# EAGLE design RFM69HCW_Breakout (EAGLE 7.7.0)
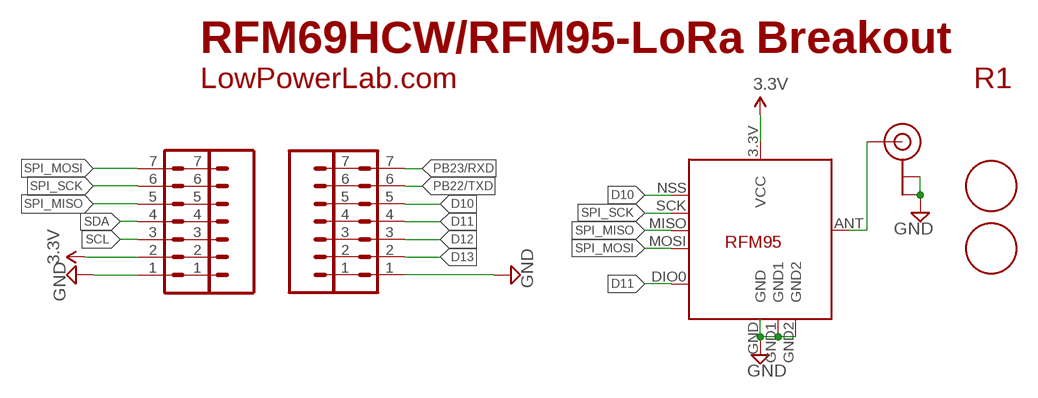
[diagram p0: schematic, sheet 1]

## Parts
FIDUCIAL_UPPERLEFT  FIDUCIAL1.5MM  [FIDUCIAL_1.5MM]
U$4  HDR_7PINNS_THINRINGS  [1X07_NS_THINRINGS]
U$9  FIDUCIAL1.5MM  [FIDUCIAL_1.5MM]
U$10  HDR_7PINNS_THINRINGS  [1X07_NS_THINRINGS]
U$16  RFM95COMPACT  [RFM95]
U$17  HDR_7PINHH  [1X07_NS_THINRINGS_HH]
U$18  HDR_7PINHH  [1X07_NS_THINRINGS_HH]
X2  U.FLW  [U.FL_WIDER]

## Nets
3.3V: U$16.3.3V(VCC) U$18.2
ANT: U$16.ANT X2.SIGNAL
D10: U$16.NSS(SEL) U$17.5
D11: U$16.DIO0 U$17.4
D12: U$17.3
D13: U$17.2
GND: U$16.GND U$16.GND1 U$16.GND2 U$17.1 U$18.1 X2.GND1(GND) X2.GND2(GND)
PB22/TXD: U$17.6
PB23/RXD: U$17.7
SCL: U$18.3
SDA: U$18.4
SPI_MISO: U$16.MISO U$18.5
SPI_MOSI: U$16.MOSI U$18.7
SPI_SCK: U$16.SCK U$18.6
Unconnected: FIDUCIAL_UPPERLEFT.P$1(FIDUCIAL) U$4.1 U$4.2 U$4.3 U$4.4 U$4.5 U$4.6 U$4.7 U$9.P$1(FIDUCIAL) U$10.1 U$10.2 U$10.3 U$10.4 U$10.5 U$10.6 U$10.7

## Notes on the sheet
- RFM69HCW/RFM95-LoRa Breakout
- LowPowerLab.com | R1

## Library data of the parts
FIDUCIAL_UPPERLEFT U$9 = LowPowerLab:FIDUCIAL
U$4 U$10 U$17 U$18 = LowPowerLab:HDR_7PIN
U$16 = LowPowerLab:RFM95
X2 = LowPowerLab:U.FL: SMD antenna connector- WRL-09144

## Net classes
1 power: width 0.381 mm, clearance 0.254 mm

## Board
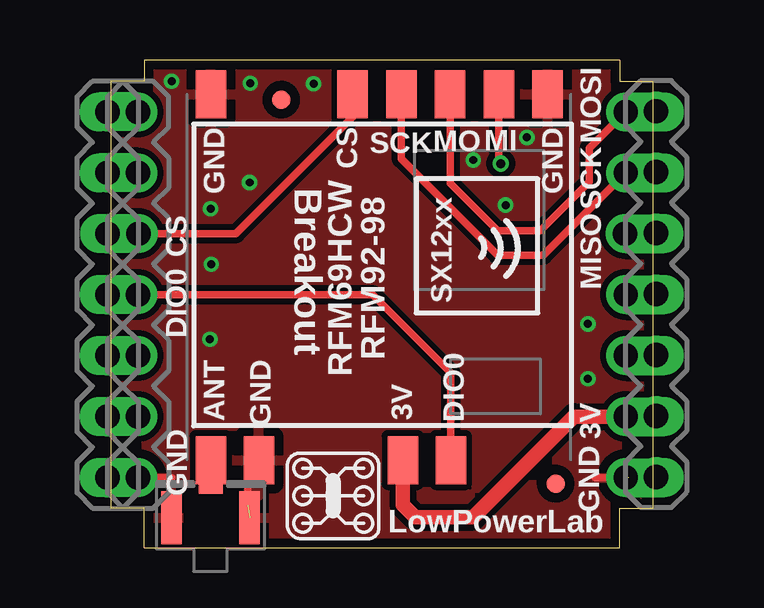
[diagram p1: board, top side]
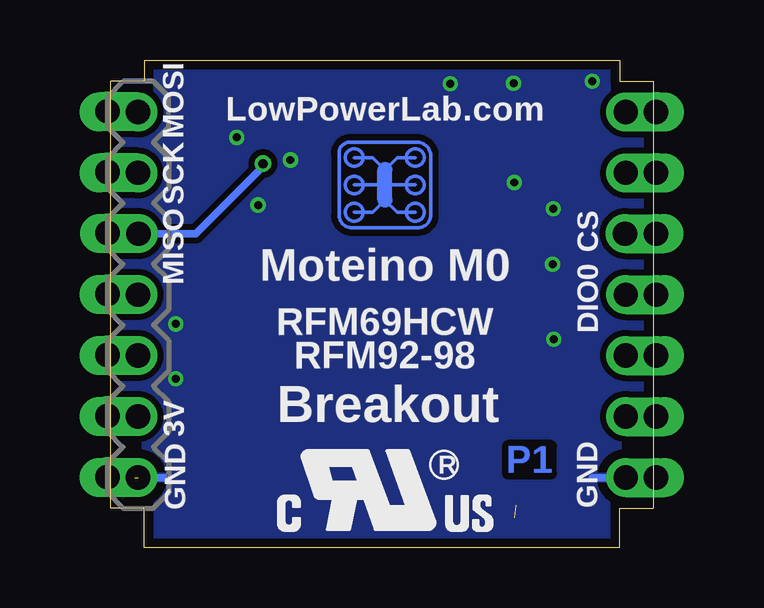
[diagram p2: board, bottom side, seen from below]

Size 22.61 x 20.32 mm. Coordinates in mm from the lower left corner, seen from the top.
Outline: 0,19.43 0,1.65 1.4,1.65 1.4,0 21.21,0 21.21,1.65 22.61,1.65 22.61,19.43 21.21,19.43 21.21,20.32 1.4,20.32 1.4,19.43 0,19.43
Copper layers (1*16): Top 0.0356mm / dielectric 1.5011mm / Bottom 0.0356mm
Design rules "LaenPCBOrder *": minimum track width 6mil, minimum drill 12mil, track to track 10mil, track to pad 10mil, pad to pad 6mil, via to via 6mil, smd to smd 6mil, copper to edge 15mil, drill to drill 10mil, minimum pad ring 10mil, minimum via ring 6mil, stop-mask expansion 2mil, vias tented up to drill 25mil, thermal gap 15mil
tRestrict: area 3,0.4 to 5.3,2.3; area 3.7,17.7 to 4.6,17.9

### Footprints (pad centres in the part's own frame; a part is rotated, then mirrored left to right if it is on the bottom)
FIDUCIAL_1.5MM = smd 0.762 x 0.762: P$1 0,0
1X07_NS_THINRINGS = drill 1.016 pad 1.626: 1 0,0; 2 2.54,0; 3 5.08,0; 4 7.62,0; 5 10.16,0; 6 12.7,0; 7 15.24,0
RFM95 = smd 2 x 1.27: 3.3V 7.651,1; ANT 7.651,-7; DIO0 7.651,3; GND 7.651,-5; GND1 -7.599,-7; GND2 -7.599,7.032; MISO -7.599,5; MOSI -7.599,2.968; NSS -7.599,-1.096; SCK -7.599,0.936
1X07_NS_THINRINGS_HH = drill 1.016 pad 1.626 offset: 1 0,0; 2 2.54,0; 3 5.08,0; 4 7.62,0; 5 10.16,-0.025; 6 12.7,0; 7 15.24,0
U.FL_WIDER = smd 2.2 x 0.85: GND1 0,1.629; GND2 0,-1.629 | smd 1.05 x 1: SIGNAL 1.525,0

### Placement (x,y rotation side)
FIDUCIAL_UPPERLEFT  18.54,2.67 270 top
U$1  [LOGO_LOWPOWERLAB]  9.27,2.16 0 top
U$2  [LOGO_UL]  15.62,0.64 0 bottom
U$3  [LOGO_LOWPOWERLAB_COPPER]  11.18,15.11 180 bottom
U$4  22.73,2.95 90 top
U$7  [LOGO_LOWPOWERLAB_STOP]  11.18,15.11 180 bottom
U$9  7.11,18.67 270 top
U$10  -0.13,2.92 90 top
U$16  11.18,11.3 270 top
U$17  1.14,2.92 90 top
U$18  21.46,2.92 90 bottom
X2  4.17,1.24 90 top

### Tracks (layer width: path | path; a pad name or v marks a point on that pad's centre or on a via)
3.3V
  Top 0.61: U$16.3.3V 12.18,1.79 12.7,1.27 15.11,1.27 19.3,5.46 U$18.2
ANT
  Top 0.305: X2.SIGNAL U$16.ANT
D10
  Top 0.305: U$16.NSS 10.08,17.95 5.21,13.08 U$17.5
D11
  Top 0.305: U$16.DIO0 14.18,7.29 10.92,10.54 U$17.4
GND  (via drill 0.33)  (3 unrouted)
  Top 0.305: U$17.1 2.54,2.92 | 20.19,2.92 21.59,2.92 | 5.71,1.78 5.71,3.17
  Bottom 0.305: U$17.1 2.54,2.92 | 20.19,2.92 21.59,2.92
  other vias: 4.19,11.81 5.82,19.35 8.46,19.33 4.17,14.12 5.79,15.21 17.35,17.09 16.46,14.27 15.11,16.15 19.89,7.04 19.89,9.32 4.14,8.69 2.54,19.43
  pour Top: 22.73,20.32 -0.13,20.32 -0.43,-0.2 22.68,-0.2
  pour Bottom: 22.73,20.32 22.68,-0.25 -0.43,-0.25 -0.13,20.32
SPI_MISO  (via drill 0.38)
  Top 0.305: U$16.MISO 16.18,16.08 v16.26,16
  Bottom 0.305: v16.26,16 16.26,15.88 19.05,13.08 U$18.5
SPI_MOSI
  Top 0.305: U$16.MOSI 14.14,15.19 16.13,13.21 17.91,13.21 19.94,15.24 19.94,16.64 U$18.7
SPI_SCK
  Top 0.305: U$16.SCK 12.11,16.21 16.13,12.19 18.03,12.19 U$18.6

### Text on the board
Bottom: P1
tPlace: MOSI | CS | SCK | MO | MI | GND | GND | Breakout | SCK | CS | SX12xx | MISO | RFM69HCW | RFM92-98 | DIO0 | ANT | DIO0 | GND | 3V | 3V | GND | GND | LowPowerLab
bPlace: MOSI | LowPowerLab.com | SCK | CS | MISO | Moteino M0 | DIO0 | RFM69HCW | RFM92-98 | Breakout | 3V | GND | GND
bStop: P1